# Altium project Localization.PrjPcb
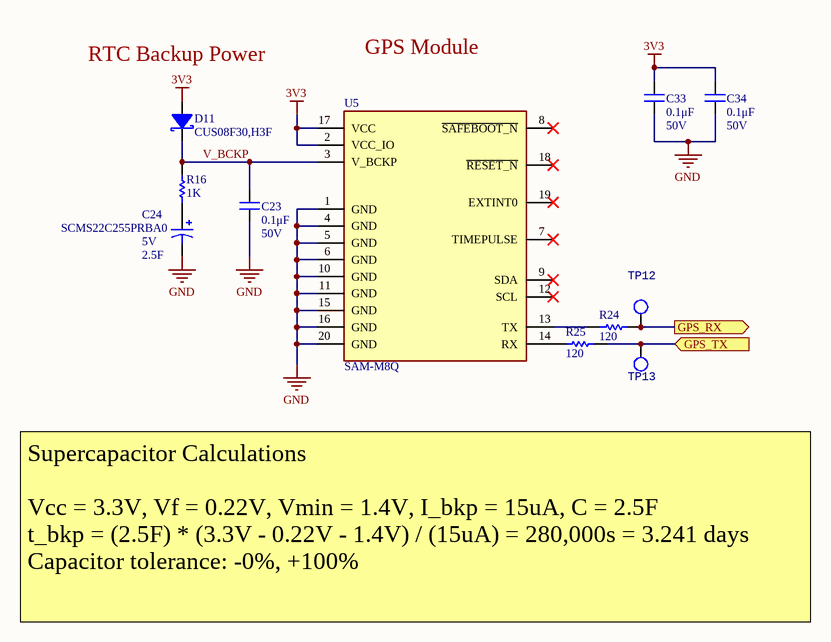
[diagram p0: GPS.SchDoc]
6 sheets, 107 parts. Net scope: flat (ports and power ports of the same name join across sheets).
Board file: Localization.PcbDoc
Sheets:
  GPS.SchDoc
  IMU.SchDoc
  MCU.SchDoc
  Power.SchDoc
  SD_CARD.SchDoc
  USB.SchDoc

## Sheet GPS.SchDoc: GPS
size B; CheckedBy: Lance Bantoto; Engineer: Cindy Li; Organization: Altium Limited; Address1: L3, 12a Rodborough Rd; Address2: Frenchs Forest; Address3: NSW; Address4: Australia 2086; Revision: 1; SheetNumber: 5; SheetTotal: 6

### Parts
C23  value 0.1μF  Voltage Rating: 50V  [CAP2012]  (hidden comment: CAP_0.1uF_50V_0805)
C24  Voltage Rating: 5V  Capacitance: 2.5F  [SCMS22C255PRBA0]  (hidden comment: CAP_2.5F_5V)
C33  value 0.1μF  Voltage Rating: 50V  [CAP2012]  (hidden comment: CAP_0.1uF_50V_0805)
C34  value 0.1μF  Voltage Rating: 50V  [CAP2012]  (hidden comment: CAP_0.1uF_50V_0805)
D11  Manufacturer Part Number 1: CUS08F30,H3F  [SOD-323_UNIDIR]  (hidden comment: DIO_SCHOTTKY_30V_800mA)
R16  value 1K  [RESC0603(1608)_N]  (hidden comment: RES_1K_0603)
R24  value 120  [RESC0603(1608)_N]  (hidden comment: RES_120R_0603)
R25  value 120  [RESC0603(1608)_N]  (hidden comment: RES_120R_0603)
TP12  TESTPOINT_LOOP  [TESTPOINT_LOOP]  (value not drawn)
TP13  TESTPOINT_LOOP  [TESTPOINT_LOOP]  (value not drawn)
U5  SAM-M8Q  [SAM-M8Q]

### Ports
GPS_RX (out), GPS_TX (in)

### Nets
3V3: C33.2 C34.2 D11.1(Anode) U5.2(VCC_IO) U5.17(VCC)
GND: C23.1 C24.2 C33.1 C34.1 U5.1(GND) U5.4(GND) U5.5(GND) U5.6(GND) U5.10(GND) U5.11(GND) U5.15(GND) U5.16(GND) U5.20(GND)
GPS_RX: R24.2 TP12.1 ; port GPS_RX
GPS_TX: R25.2 TP13.1 ; port GPS_TX
V_BCKP: C23.2 D11.2(Cathode) R16.1 U5.3(V_BCKP)
NetC24_1: C24.1 R16.2
NetR24_1: R24.1 U5.13(TX)
NetR25_1: R25.1 U5.14(RX)

Not connected (* = marked no-connect by the designer): U5 7(TIMEPULSE)* 8(~{SAFEBOOT_N})* 9(SDA)* 12(SCL)* 18(~{RESET_N})* 19(EXTINT0)*

### Notes on the sheet
- (near D11) RTC Backup Power
- GPS Module
- Supercapacitor Calculations
  Vcc = 3.3V, Vf = 0.22V, Vmin = 1.4V, I_bkp = 15uA, C = 2.5F
  t_bkp = (2.5F) * (3.3V - 0.22V - 1.4V) / (15uA) = 280,000s = 3.241 days
  Capacitor tolerance: -0%, +100%
- Title:
- Project:
- Date:
- Rev:
- Checker:
- Engineer:
- Sheet:
- of

### Library data of the parts
C23 C33 C34 = CAP_0.1uF_50V_0805: CAP CER 0.1UF 50V X7R 0805; Manufacturer 1: Murata Electronics; Manufacturer Part Number 1: GCD21BR71H104KA01L; Tolerance: 10%; Mount: Surface Mount; Case Code (Metric): 2012; Case Code (Imperial): 0805; Min Operating Temperature: -55°C; Max Operating Temperature: 125°C; Dielectric: X7R; Termination: SMD/SMT; Length: 2mm; Height: 1.25mm; Width: 0.049inch; Thickness: 0.049inch; Depth: 1.25mm; Ratings: AEC-Q200; Supplier 1: Digi-Key; Supplier Part Number 1: 490-11955-1-ND; Package: 0805 (2012 Metric)
C24 = CAP_2.5F_5V: CAP 2.5F 5V; Manufacturer 1: AVX Corporation; Tolerance: 0%, +100%; Manufacturer Part Number 1: SCMS22C255PRBA0; RoHS: Yes; Mount: Through Hole; Case/Package: Radial; Min Operating Temperature: -40°C; Max Operating Temperature: 85°C; Voltage Rating (DC): 5V; Dimensions: 0.787" L x 0.394" W (20.00mm x 10.00mm); Height - Seated (Max): 0.925" (23.50mm); Supplier 1: Digi-Key
D11 = DIO_SCHOTTKY_30V_800mA: DIODE SCHOTTKY 30V 800MA USC; Manufacturer 1: Toshiba Semiconductor and Storage; Vf (Max): 220mV; Supplier 1: Digi-Key; Supplier Part Number 1: CUS08F30H3FCT-ND; Mount: Surface Mount; Vr (Max): 30V; Io: 800mA
R16 = RES_1K_0603: RES SMD 1K OHM 5% 1/10W 0603; Manufacturer 1: Yageo; Manufacturer Part Number 1: RC0603JR-071KL; Dimensions: 0.063" L x 0.031" W (1.60mm x 0.80mm); Tolerance: 5%; Package: 0603 (1608 Metric); Supplier Part Number 1: 311-1.0KGRCT-ND; Supplier 1: Digi-Key; Mount: Surface Mount
R24 R25 = RES_120R_0603: RES SMD 120 OHM 5% 1/10W 0603; Manufacturer 1: Yageo; Manufacturer Part Number 1: RC0603JR-07120RL; Package: 0603 (1608 Metric); Dimensions: 0.063" L x 0.031" W (1.60mm x 0.80mm); Tolerance: 5%; Supplier Part Number 1: 311-120GRCT-ND; Supplier 1: Digi-Key; Mount: Surface Mount
TP12 TP13 = TESTPOINT_LOOP: PC TEST POINT MINIATURE WHITE; Manufacturer Part Number 1: 5002; Manufacturer 1: Keystone Electronics; Supplier Part Number 1: 36-5002-ND; Supplier 1: Digi-Key; Mount: Through Hole
U5 = SAM-M8Q: Rf Rx Galileo 1.575GHZ/1.602GHZ; Manufacturer 1: u-blox; Manufacturing Part Number 1: SAM-M8Q-0-10; Interface: I2C,SPI,USB,UART; Sensitivity: -165dBm; Data Rate: 400Kbps; Supplier 1: Digi-Key; Case/Package: SMD/SMT; Min Operating Temperature: -40°C; Max Operating Temperature: 85°C; Frequency: 1.602GHz; Supplier Part Number 1: 672-1054-1-ND

## Sheet IMU.SchDoc: IMU
size B; CheckedBy: Lance Bantoto; Engineer: Cindy Li; Organization: Altium Limited; Address1: L3, 12a Rodborough Rd; Address2: Frenchs Forest; Address3: NSW; Address4: Australia 2086; Revision: 1; SheetNumber: 4; SheetTotal: 6
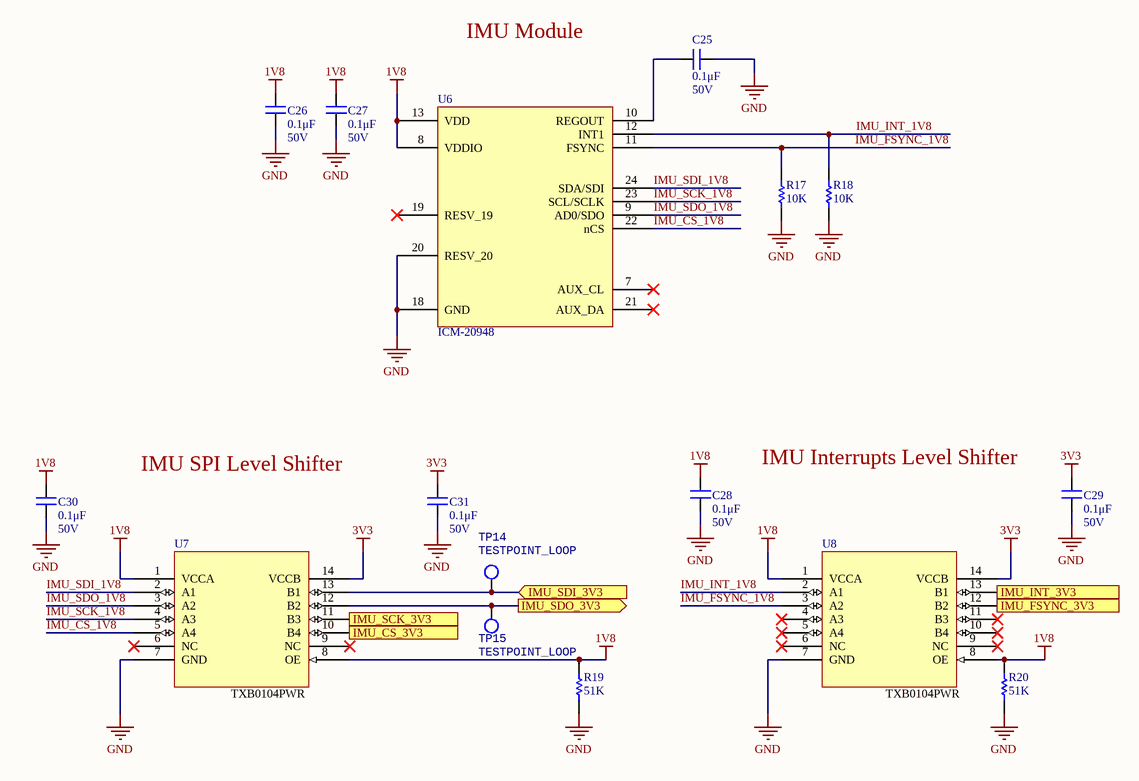
[diagram p1: IMU.SchDoc]

### Parts
C25  value 0.1μF  Voltage Rating: 50V  [CAP2012]  (hidden comment: CAP_0.1uF_50V_0805)
C26  value 0.1μF  Voltage Rating: 50V  [CAP2012]  (hidden comment: CAP_0.1uF_50V_0805)
C27  value 0.1μF  Voltage Rating: 50V  [CAP2012]  (hidden comment: CAP_0.1uF_50V_0805)
C28  value 0.1μF  Voltage Rating: 50V  [CAP2012]  (hidden comment: CAP_0.1uF_50V_0805)
C29  value 0.1μF  Voltage Rating: 50V  [CAP2012]  (hidden comment: CAP_0.1uF_50V_0805)
C30  value 0.1μF  Voltage Rating: 50V  [CAP2012]  (hidden comment: CAP_0.1uF_50V_0805)
C31  value 0.1μF  Voltage Rating: 50V  [CAP2012]  (hidden comment: CAP_0.1uF_50V_0805)
R17  value 10K  [RESC0603(1608)_N]  (hidden comment: RES_10K_0603)
R18  value 10K  [RESC0603(1608)_N]  (hidden comment: RES_10K_0603)
R19  value 51K  [RESC1608X55N]  (hidden comment: RES_51K_0603)
R20  value 51K  [RESC1608X55N]  (hidden comment: RES_51K_0603)
TP14  TESTPOINT_LOOP  [TESTPOINT_LOOP]
TP15  TESTPOINT_LOOP  [TESTPOINT_LOOP]
U6  IC_9DOF_IMU  [ICM-20948]  (value not drawn)
U7  TXB0104PWR  [PW14]
U8  TXB0104PWR  [PW14]

### Ports
IMU_CS_3V3 (in), IMU_FSYNC_3V3 (in), IMU_INT_3V3 (out), IMU_SCK_3V3 (in), IMU_SDI_3V3 (in), IMU_SDO_3V3 (out)

### Nets
1V8: C26.2 C27.2 C28.2 C30.2 R19.2 R20.2 U6.8(VDDIO) U6.13(VDD) U7.1(VCCA) U7.8(OE) U8.1(VCCA) U8.8(OE)
3V3: C29.2 C31.2 U7.14(VCCB) U8.14(VCCB)
GND: C25.2 C26.1 C27.1 C28.1 C29.1 C30.1 C31.1 R17.1 R18.1 R19.1 R20.1 U6.18(GND) U6.20(RESV_20) U7.7(GND) U8.7(GND)
IMU_CS_1V8: U6.22(nCS) U7.5(A4)
IMU_CS_3V3: U7.10(B4) ; port IMU_CS_3V3
IMU_FSYNC_1V8: R17.2 U6.11(FSYNC) U8.3(A2)
IMU_FSYNC_3V3: U8.12(B2) ; port IMU_FSYNC_3V3
IMU_INT_1V8: R18.2 U6.12(INT1) U8.2(A1)
IMU_INT_3V3: U8.13(B1) ; port IMU_INT_3V3
IMU_SCK_1V8: U6.23(SCL/SCLK) U7.4(A3)
IMU_SCK_3V3: U7.11(B3) ; port IMU_SCK_3V3
IMU_SDI_1V8: U6.24(SDA/SDI) U7.2(A1)
IMU_SDI_3V3: TP14.1 U7.13(B1) ; port IMU_SDI_3V3
IMU_SDO_1V8: U6.9(AD0/SDO) U7.3(A2)
IMU_SDO_3V3: TP15.1 U7.12(B2) ; port IMU_SDO_3V3
NetC25_1: C25.1 U6.10(REGOUT)

Not connected (* = marked no-connect by the designer): U6 7(AUX_CL)* 19(RESV_19)* 21(AUX_DA)*; U7 6(NC)* 9(NC)*; U8 4(A3)* 5(A4)* 6(NC)* 9(NC)* 10(B4)* 11(B3)*

### Notes on the sheet
- IMU Module
- IMU SPI Level Shifter
- (near C29) IMU Interrupts Level Shifter
- Title:
- Project:
- Date:
- Rev:
- Checker:
- Engineer:
- Sheet:
- of

### Library data of the parts
C25-C31 = CAP_0.1uF_50V_0805: as C23 on sheet GPS; Mount: Surface Mount; Case Code (Metric): 2012; Case Code (Imperial): 0805; Min Operating Temperature: -55°C; Max Operating Temperature: 125°C; Dielectric: X7R; Termination: SMD/SMT; Length: 2mm; Height: 1.25mm; Width: 0.049inch; Thickness: 0.049inch; Depth: 1.25mm; Ratings: AEC-Q200; Supplier 1: Digi-Key; Supplier Part Number 1: 490-11955-1-ND; Package: 0805 (2012 Metric)
R17 R18 = RES_10K_0603: RES SMD 10K OHM 5% 1/10W 0603; Manufacturer 1: Yageo; Manufacturer Part Number 1: RC0603JR-0710KL; Package: 0603 (1608 Metric); Dimensions: 0.063" L x 0.031" W (1.60mm x 0.80mm); Tolerance: 5%; Supplier Part Number 1: 311-10KGRCT-ND; Supplier 1: Digi-Key; Mount: Surface Mount
R19 R20 = RES_51K_0603: RES SMD 51K OHM 5% 1/10W 0603; Manufacturer 1: Yageo; Manufacturer Part Number 1: RC0603JR-0751KL; Package: 0603 (1608 Metric); Dimensions: 0.063" L x 0.031" W (1.60mm x 0.80mm); Tolerance: 5%; Supplier Part Number 1: 311-51KGRCT-ND; Supplier 1: Digi-Key; Mount: Surface Mount
TP14 TP15 = TESTPOINT_LOOP: as TP12 on sheet GPS; Supplier Part Number 1: 36-5002-ND; Supplier 1: Digi-Key; Mount: Through Hole
U6 = IC_9DOF_IMU: IMU ACCEL/GYRO/COMPI2C/SPI 24QFN; Manufacturer: TDK InvenSense; Sensor Type: Accelerometer,Gyroscope,Magnetometer; Output Type: SPI,I2C; Supplier 1: Digi-Key; Category: Inertial Measurement Units (IMUs); Mount: Surface Mount; Case/Package: QFN; Min Operating Temperature: -40°C; Max Operating Temperature: 85°C; Supplier Part Number 1: 1428-1123-1-ND; Manufacturer Part Number: ICM-20948
U7 U8 = IC_4CH_LVL_SHIFTER: 4-Bit Bidirectional Voltage-Level Translator with Auto Direction Sensing / VCCA < VCCB, see datasheet; Manufacturer 1: Texas Instruments; PACKAGE_DESIGNATOR: PW; PIN_COUNT: 14; FAMILY_NAME: AUTO DIRECTION SENSING DUAL SUPPLY TRANSLATOR; INDUSTRY_STD_PKG_TYPE: TSSOP; VCCB MAX: 5.5 V; VCCA MAX: 3.6 V; GENERIC_PART_NUMBER: TXB0104; Datasheet_URL: http://www.ti.com/lit/gpn/TXB0104; Supplier 1: Digi-Key; Supplier Part Number 1: 296-21929-1-ND; Manufacturer Part Number 1: TXB0104PWR

## Sheet MCU.SchDoc: Microcontroller
size B; CheckedBy: Lance Bantoto; Engineer: Cindy Li; Organization: Altium Limited; Address1: L3, 12a Rodborough Rd; Address2: Frenchs Forest; Address3: NSW; Address4: Australia 2086; Revision: 1; SheetNumber: 3; SheetTotal: 6
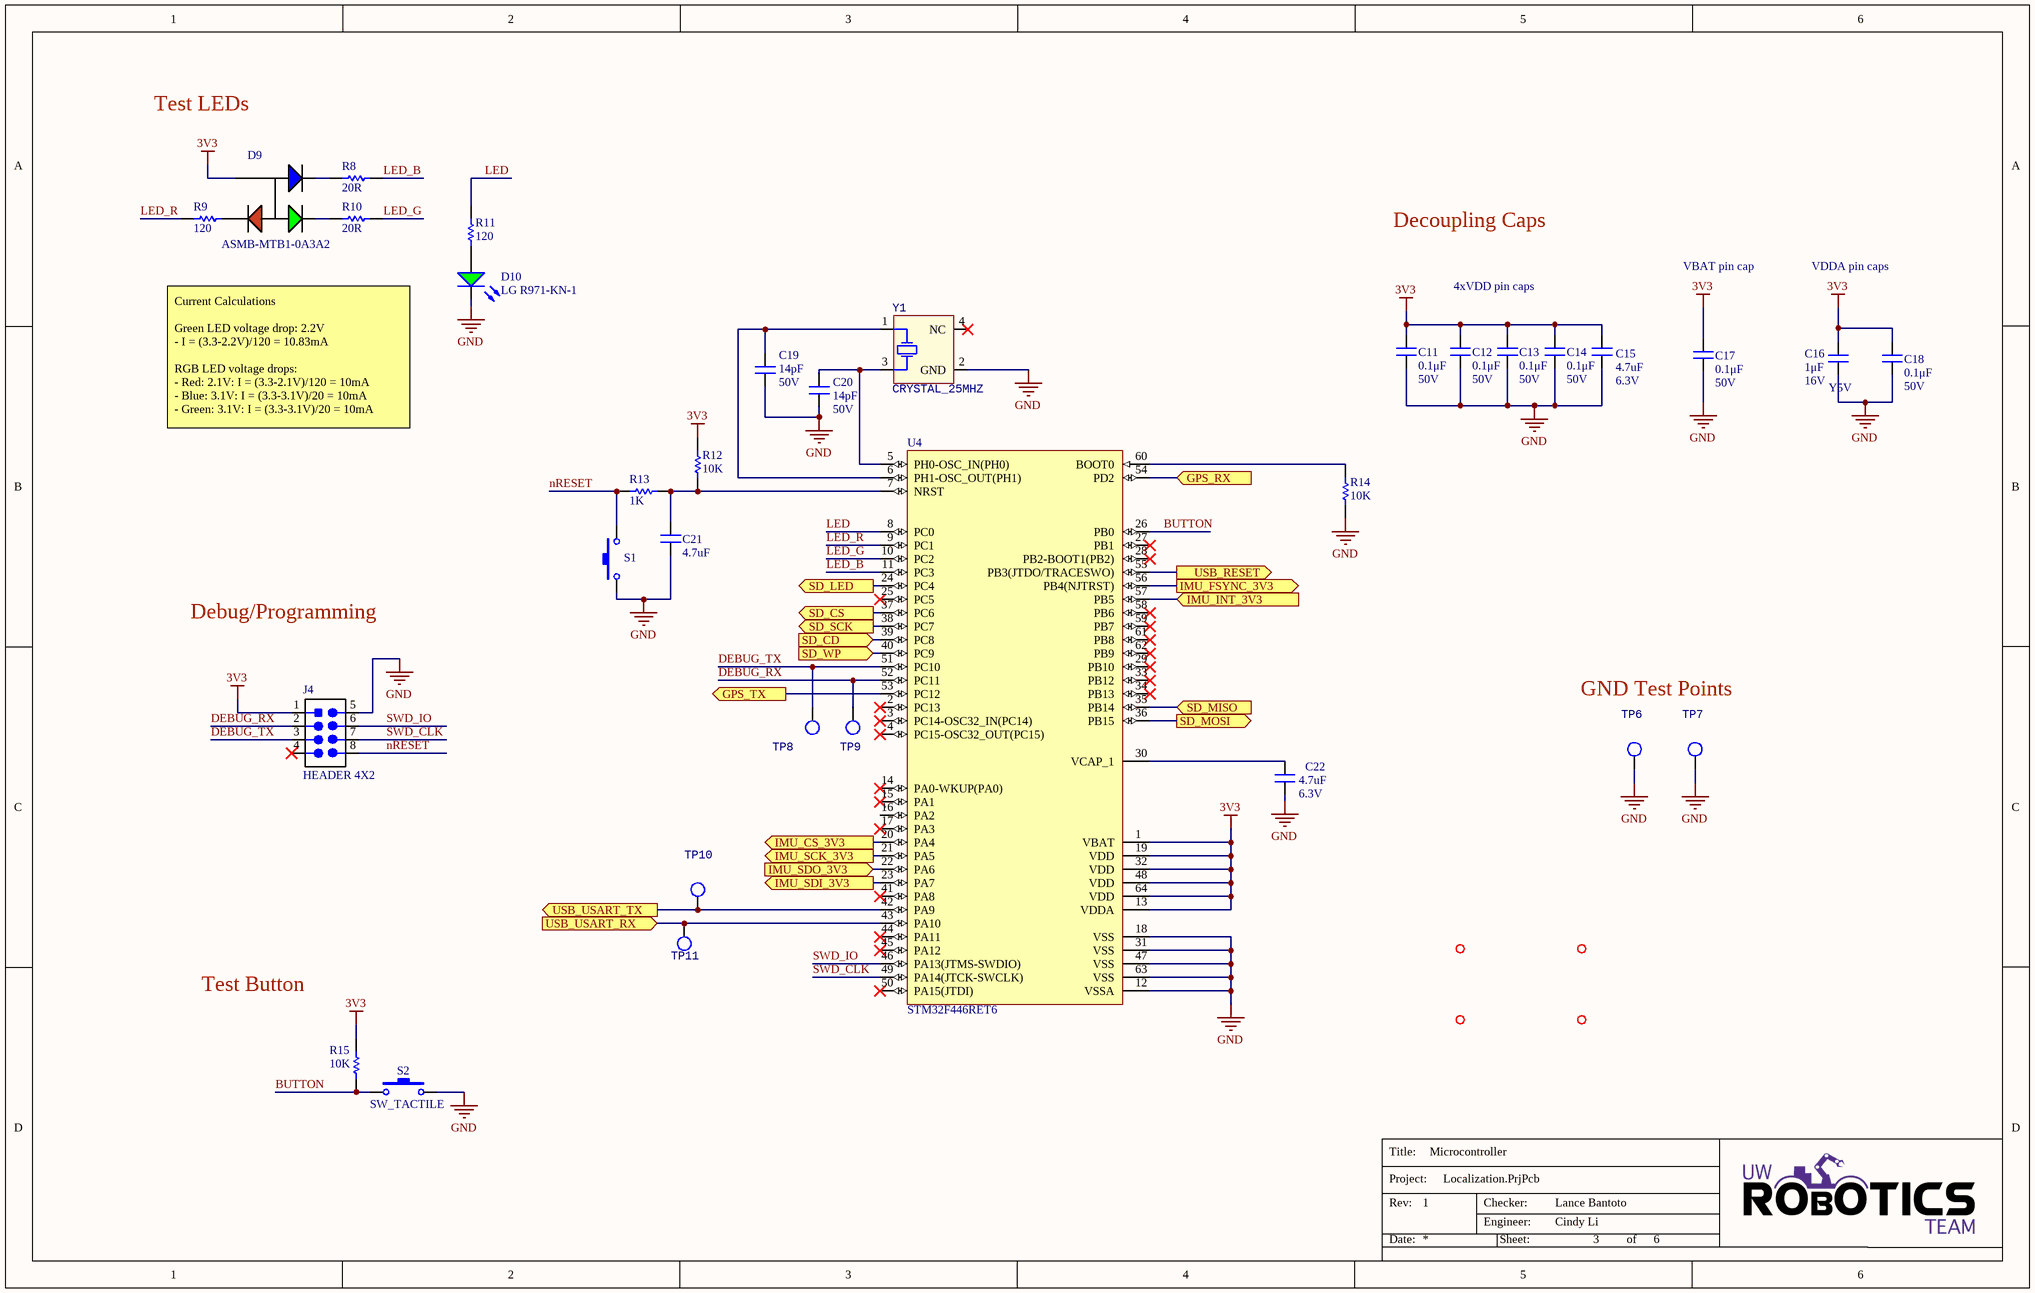
[diagram p2: MCU.SchDoc]

### Parts
C11  value 0.1μF  Voltage Rating: 50V  [CAP2012]  (hidden comment: CAP_0.1uF_50V_0805)
C12  value 0.1μF  Voltage Rating: 50V  [CAP2012]  (hidden comment: CAP_0.1uF_50V_0805)
C13  value 0.1μF  Voltage Rating: 50V  [CAP2012]  (hidden comment: CAP_0.1uF_50V_0805)
C14  value 0.1μF  Voltage Rating: 50V  [CAP2012]  (hidden comment: CAP_0.1uF_50V_0805)
C15  value 4.7uF  Voltage Rating: 6.3V  [CAPC0603(1608)55_N]  (hidden comment: CAP_4.7uF_0603)
C16  value 1μF  Voltage Rating: 16V  Dielectric: Y5V  [CAP0603]  (hidden comment: CAP_1uF_16V_0603)
C17  value 0.1μF  Voltage Rating: 50V  [CAP2012]  (hidden comment: CAP_0.1uF_50V_0805)
C18  value 0.1μF  Voltage Rating: 50V  [CAP2012]  (hidden comment: CAP_0.1uF_50V_0805)
C19  value 14pF  Voltage Rating (DC): 50V  [CAPC0603(1608)55_N]  (hidden comment: CL10C140JB8NNNC)
C20  value 14pF  Voltage Rating (DC): 50V  [CAPC0603(1608)55_N]  (hidden comment: CL10C140JB8NNNC)
C21  value 4.7uF  [CAPC0603(1608)55_N]  (hidden comment: CAP_4.7uF_0603)
C22  value 4.7uF  Voltage Rating: 6.3V  [CAPC0603(1608)55_N]  (hidden comment: CAP_4.7uF_0603)
D9  Manufacturer Part Number 1: ASMB-MTB1-0A3A2  [LED_RGB]  (hidden comment: LED_RGB)
D10  LG R971-KN-1  [LED_0805_GREEN]
J4  HEADER 4X2  [HEADER_2X4]
MH1  MOUNTING_HOLES  [MOUNTING_HOLE]  (value not drawn)
MH2  MOUNTING_HOLES  [MOUNTING_HOLE]  (value not drawn)
MH3  MOUNTING_HOLES  [MOUNTING_HOLE]  (value not drawn)
MH4  MOUNTING_HOLES  [MOUNTING_HOLE]  (value not drawn)
R8  value 20R  [RESC0603(1608)_N]  (hidden comment: RES_20R_0603)
R9  value 120  [RESC0603(1608)_N]  (hidden comment: RES_120R_0603)
R10  value 20R  [RESC0603(1608)_N]  (hidden comment: RES_20R_0603)
R11  value 120  [RESC0603(1608)_N]  (hidden comment: RES_120R_0603)
R12  value 10K  [RESC0603(1608)_N]  (hidden comment: RES_10K_0603)
R13  value 1K  [RESC0603(1608)_N]  (hidden comment: RES_1K_0603)
R14  value 10K  [RESC0603(1608)_N]  (hidden comment: RES_10K_0603)
R15  value 10K  [RESC0603(1608)_N]  (hidden comment: RES_10K_0603)
S1  SW_TACTILE  [B3U-1000P]  (value not drawn)
S2  SW_TACTILE  [B3U-1000P]
TP6  TESTPOINT_LOOP  [TESTPOINT_LOOP]  (value not drawn)
TP7  TESTPOINT_LOOP  [TESTPOINT_LOOP]  (value not drawn)
TP8  TESTPOINT_LOOP  [TESTPOINT_LOOP]  (value not drawn)
TP9  TESTPOINT_LOOP  [TESTPOINT_LOOP]  (value not drawn)
TP10  TESTPOINT_LOOP  [TESTPOINT_LOOP]  (value not drawn)
TP11  TESTPOINT_LOOP  [TESTPOINT_LOOP]  (value not drawn)
U4  STM32F446RET6  [STM-LQFP64_L]
Y1  CRYSTAL_25MHZ  [SOIC254P1016X440-4N]

### Ports
GPS_RX (in), GPS_TX (out), IMU_CS_3V3 (out), IMU_FSYNC_3V3 (out), IMU_INT_3V3 (in), IMU_SCK_3V3 (out), IMU_SDI_3V3 (out), IMU_SDO_3V3 (in), SD_CD (in), SD_CS (out), SD_LED (out), SD_MISO (in), SD_MOSI (out), SD_SCK (out), SD_WP (in), USB_RESET (out), USB_USART_RX (in), USB_USART_TX (out)

### Nets
3V3: C11.2 C12.2 C13.2 C14.2 C15.2 C16.2 C17.2 C18.2 D9.4(COMMON_ANODE) J4.1(VCC) R12.2 R15.1 U4.1(VBAT) U4.13(VDDA) U4.19(VDD) U4.32(VDD) U4.48(VDD) U4.64(VDD)
GND: C11.1 C12.1 C13.1 C14.1 C15.1 C16.1 C17.1 C18.1 C19.1 C20.1 C21.1 C22.1 D10.2(K) J4.5(GND) R14.2 S1.1 S2.2 TP6.1 TP7.1 U4.12(VSSA) U4.18(VSS) U4.31(VSS) U4.47(VSS) U4.63(VSS) Y1.2(GND)
BUTTON: R15.2 S2.1 U4.26(PB0)
DEBUG_RX: J4.2 TP9.1 U4.52(PC11)
DEBUG_TX: J4.3 TP8.1 U4.51(PC10)
GPS_RX: U4.54(PD2) ; port GPS_RX
GPS_TX: U4.53(PC12) ; port GPS_TX
IMU_CS_3V3: U4.20(PA4) ; port IMU_CS_3V3
IMU_FSYNC_3V3: U4.56(PB4(NJTRST)) ; port IMU_FSYNC_3V3
IMU_INT_3V3: U4.57(PB5) ; port IMU_INT_3V3
IMU_SCK_3V3: U4.21(PA5) ; port IMU_SCK_3V3
IMU_SDI_3V3: U4.23(PA7) ; port IMU_SDI_3V3
IMU_SDO_3V3: U4.22(PA6) ; port IMU_SDO_3V3
LED: R11.1 U4.8(PC0)
LED_B: R8.2 U4.11(PC3)
LED_G: R10.2 U4.10(PC2)
LED_R: R9.1 U4.9(PC1)
nRESET: J4.8 R13.1 S1.2
SD_CD: U4.39(PC8) ; port SD_CD
SD_CS: U4.37(PC6) ; port SD_CS
SD_LED: U4.24(PC4) ; port SD_LED
SD_MISO: U4.35(PB14) ; port SD_MISO
SD_MOSI: U4.36(PB15) ; port SD_MOSI
SD_SCK: U4.38(PC7) ; port SD_SCK
SD_WP: U4.40(PC9) ; port SD_WP
SWD_CLK: J4.7 U4.49(PA14(JTCK-SWCLK))
SWD_IO: J4.6 U4.46(PA13(JTMS-SWDIO))
USB_RESET: U4.55(PB3(JTDO/TRACESWO)) ; port USB_RESET
USB_USART_RX: TP11.1 U4.43(PA10) ; port USB_USART_RX
USB_USART_TX: TP10.1 U4.42(PA9) ; port USB_USART_TX
NetC19_2: C19.2 U4.6(PH1-OSC_OUT(PH1)) Y1.1(HOT)
NetC20_2: C20.2 U4.5(PH0-OSC_IN(PH0)) Y1.3(HOT)
NetC21_2: C21.2 R12.1 R13.2 U4.7(NRST)
NetC22_2: C22.2 U4.30(VCAP_1)
NetD9_1: D9.1(CATHODE_(RED)) R9.2
NetD9_2: D9.2(CATHODE_(GREEN)) R10.1
NetD9_3: D9.3(CATHODE_(BLUE)) R8.1
NetD10_1: D10.1(A) R11.2
NetR14_1: R14.1 U4.60(BOOT0)

Not connected (* = marked no-connect by the designer): J4 4*; U4 2(PC13)* 3(PC14-OSC32_IN(PC14))* 4(PC15-OSC32_OUT(PC15))* 14(PA0-WKUP(PA0))* 15(PA1)* 16(PA2) 17(PA3)* 25(PC5)* 27(PB1)* 28(PB2-BOOT1(PB2))* 29(PB10)* 33(PB12)* 34(PB13)* 41(PA8)* 44(PA11)* 45(PA12)* 50(PA15(JTDI))* 58(PB6)* 59(PB7)* 61(PB8)* 62(PB9)*; Y1 4(NC)*

### Notes on the sheet
- Test LEDs
- Decoupling Caps
- 4xVDD pin caps
- VBAT pin cap
- VDDA pin caps
- Current Calculations
  Green LED voltage drop: 2.2V
  - I = (3.3-2.2V)/120 = 10.83mA
  RGB LED voltage drops:
  - Red: 2.1V: I = (3.3-2.1V)/120 = 10mA
  - Blue: 3.1V: I = (3.3-3.1V)/20 = 10mA
  - Green: 3.1V: I = (3.3-3.1V)/20 = 10mA
- Debug/Programming
- GND Test Points
- Test Button
- Title:
- Project:
- Date:
- Rev:
- Checker:
- Engineer:
- Sheet:
- of

### Library data of the parts
C11-C14 C17 C18 = CAP_0.1uF_50V_0805: as C23 on sheet GPS; Mount: Surface Mount; Case Code (Metric): 2012; Case Code (Imperial): 0805; Min Operating Temperature: -55°C; Max Operating Temperature: 125°C; Dielectric: X7R; Termination: SMD/SMT; Length: 2mm; Height: 1.25mm; Width: 0.049inch; Thickness: 0.049inch; Depth: 1.25mm; Ratings: AEC-Q200; Supplier 1: Digi-Key; Supplier Part Number 1: 490-11955-1-ND; Package: 0805 (2012 Metric)
C15 C21 C22 = CAP_4.7uF_0603: CAP CER 4.7UF 6.3V X5R 0603; Manufacturer Part Number 1: CC0603KRX5R5BB475; Manufacturer 1: Yageo; Dimensions: 0.063" L x 0.031" W (1.60mm x 0.80mm); Package: 0603 (1608 Metric); Temperature Coefficient: X5R; Supplier Part Number 1: 311-1521-1-ND; Supplier 1: Digi-Key; Mount: Surface Mount
  C21: Voltage Rating: 6.3V
C16 = CAP_1uF_16V_0603: CAP CER 1UF 16V Y5V 0603; Manufacturer 1: Yageo; Manufacturer Part Number: CC0603ZRY5V7BB105; Dimensions: 0.063" L x 0.031" W (1.60mm x 0.80mm); Package: 0603 (1608 Metric); Temperature Coefficient: Y5V; Supplier Part Number 1: 311-1372-1-ND; Supplier 1: Digi-Key; Mount: Surface Mount; Case Code (Imperial): 0603; Case Code (Metric): 1608; Manufacturer Part Number 1: CC0603ZRY5V7BB105
C19 C20 = CL10C140JB8NNNC: Cap Ceramic 14pF 50V C0G 5% SMD 0603 125C Cardboard T/R; Manufacturer 1: Samsung; Voltage Rating: 50V; Supplier Part Number 1: 1276-2187-1-ND; Supplier 1: Digi-Key; Manufacturer Part Number 1: CL10C140JB8NNNC; Stock 1: 187088; Pricing 1: 1=0.10000, 10=0.06700, 100=0.02980, 500=0.02130, 1000=0.01673 (USD); RoHS: Yes; Mount: Surface Mount; Case/Package: 0603; Case Code (Metric): 1608; Case Code (Imperial): 0603; Min Operating Temperature: -55°C; Max Operating Temperature: 125°C; Tolerance: 5%; Package Quantity: 1; Packaging: Tape and Reel; Dielectric: C0G; Length: 1.6mm; Height: 0.8mm; Width: 0.031inch; Depth: 0.8mm; Thickness: 0.035inch; Radiation Hardening: No; ComponentLink1URL: https://datasheet.ciiva.com/25782/cl10c140jb8nnnc-25782947.pdf?src-supplier=Digi-Key; ComponentLink1Description: https://datasheet.ciiva.com/25782/cl10c140jb8nnnc-25782947.pdf?src-supplier=Digi-Key; Capacitance: 14pF
D9 = LED_RGB: LED RGB DIFFUSED 4PLCC SMD; Manufacturer 1: Broadcom; Color: Blue,Green,Red; Lens Color: White; Viewing Angle: 115°; Lens Style: Round; Luminous Intensity: 350mcd; Dominant Wavelength: 470nm; Forward Voltage: 3.1V; Test Current: 20mA; Supplier 1: Digi-Key; Mount: Surface Mount; Case/Package: PLCC; Number of Pins: 4; Lens Transparency: Diffused; Length: 3.2mm; Height: 1.9mm; Width: 2.8mm; REACH SVHC: No SVHC; Supplier Part Number 1: 516-3280-1-ND
D10 = DIO_LED_G: LED GREEN DIFFUSED 0805 SMD; Manufacturer 1: OSRAM; Forward Voltage Drop: 2.2V; Package: 0805 (2012 Metric); Supplier Part Number 1: 475-1410-1-ND; Supplier 1: Digi-Key; Manufacturer Part Number 1: LG R971-KN-1; Mount: Surface Mount
J4 = HEADER 4X2: CONN HEADER VERT 8POS 2.54MM; Manufacturer Part Number 1: M20-9980445; Manufacturer 1: Harwin Inc.; Supplier Part Number 1: 952-2122-ND; Supplier 1: Digi-Key; Mount: Through Hole
MH1-MH4 = MOUNTING_HOLES: 6cm x 6cm
R8 R10 = RES_20R_0603: RES SMD 20 OHM 5% 1/10W 0603; Manufacturer 1: Yageo; Manufacturer Part Number 1: RC0603JR-0720RL; Package: 0603 (1608 Metric); Dimensions: 0.063" L x 0.031" W (1.60mm x 0.80mm); Tolerance: 5%; Supplier Part Number 1: 311-20GRCT-ND; Supplier 1: Digi-Key; Mount: Surface Mount
R9 R11 = RES_120R_0603: as R24 on sheet GPS; Package: 0603 (1608 Metric); Dimensions: 0.063" L x 0.031" W (1.60mm x 0.80mm); Tolerance: 5%; Supplier Part Number 1: 311-120GRCT-ND; Supplier 1: Digi-Key; Mount: Surface Mount
R12 R14 R15 = RES_10K_0603: as R17 on sheet IMU; Package: 0603 (1608 Metric); Dimensions: 0.063" L x 0.031" W (1.60mm x 0.80mm); Tolerance: 5%; Supplier Part Number 1: 311-10KGRCT-ND; Supplier 1: Digi-Key; Mount: Surface Mount
R13 = RES_1K_0603: as R16 on sheet GPS; Dimensions: 0.063" L x 0.031" W (1.60mm x 0.80mm); Tolerance: 5%; Package: 0603 (1608 Metric); Supplier Part Number 1: 311-1.0KGRCT-ND; Supplier 1: Digi-Key; Mount: Surface Mount
S1 S2 = SW_TACTILE: Tactile Switch (Grey); Manufacturer 1: Omron Electronics Inc-EMC Div; Supplier Part Number 1: SW1020CT-ND; Supplier 1: Digi-Key; Manufacturer Part Number 1: B3U-1000P; Mount: Surface Mount
TP6-TP11 = TESTPOINT_LOOP: as TP12 on sheet GPS; Supplier Part Number 1: 36-5002-ND; Supplier 1: Digi-Key; Mount: Through Hole
U4 = MCU_STM32F446RET6: ARM Cortex-M4 32-bit MCU+FPU, 512 KB Flash, 128 KB Internal RAM, 50 I/Os, 64-Pin LQFP, -40 to 85 degC, Tray; I/Os (High Current): 50; Supply Voltage(Vcc) min (V): 1.7; Operating Frequency(F) (Processor speed) (MHz): 180; D/A Converter: 2; Internal RAM Size (kB): 128; FLASH Size (Prog) (kB): 512; Core: ARM Cortex-M4; ComponentLink1Description: Manufacturer URL; Package Reference: 64-Pin Low-profile Quad Flat Package, Body 10 x 10 mm, Pitch 0.5 mm; ComponentLink2URL: http://www.st.com/st-web-ui/static/active/en/resource/technical/document/datasheet/DM00141306.pdf; Packing: Tray; DatasheetVersion: Rev. 6; ComponentLink1URL: http://www.st.com/; ComponentLink2Description: Datasheet; Package Description: LQFP64; Mounting Technology: Surface Mount; Supplier Part Number 1: 497-15376-ND; Supplier 1: Digi-Key
Y1 = CRYSTAL_25MHZ: CRYSTAL 25.0000MHZ 12PF SMD; Manufacturer 1: Kyocera AVX; Manufacturer Part Number 1: CX2520DB25000H0FLJC1; Frequency: 25MHz; ESR (Equivalent Series Resistance): 80R; Frequency Stability: 15ppm; Frequency Tolerance: 10ppm; Supplier 1: Digi-Key; Supplier Part Number 1: 1253-1724-1-ND; Mount: Surface Mount; Case/Package: SMD/SMT; Min Operating Temperature: -30°C; Max Operating Temperature: 85°C; Load Capacitance: 12pF; Length: 0.098inch; Height: 0.022inch; Width: 0.079inch; Ratings: AEC-Q200

## Sheet Power.SchDoc: Power
size B; CheckedBy: Lance Bantoto; Engineer: Cindy Li; Organization: Altium Limited; Address1: L3, 12a Rodborough Rd; Address2: Frenchs Forest; Address3: NSW; Address4: Australia 2086; Revision: 1; SheetNumber: 1; SheetTotal: 6
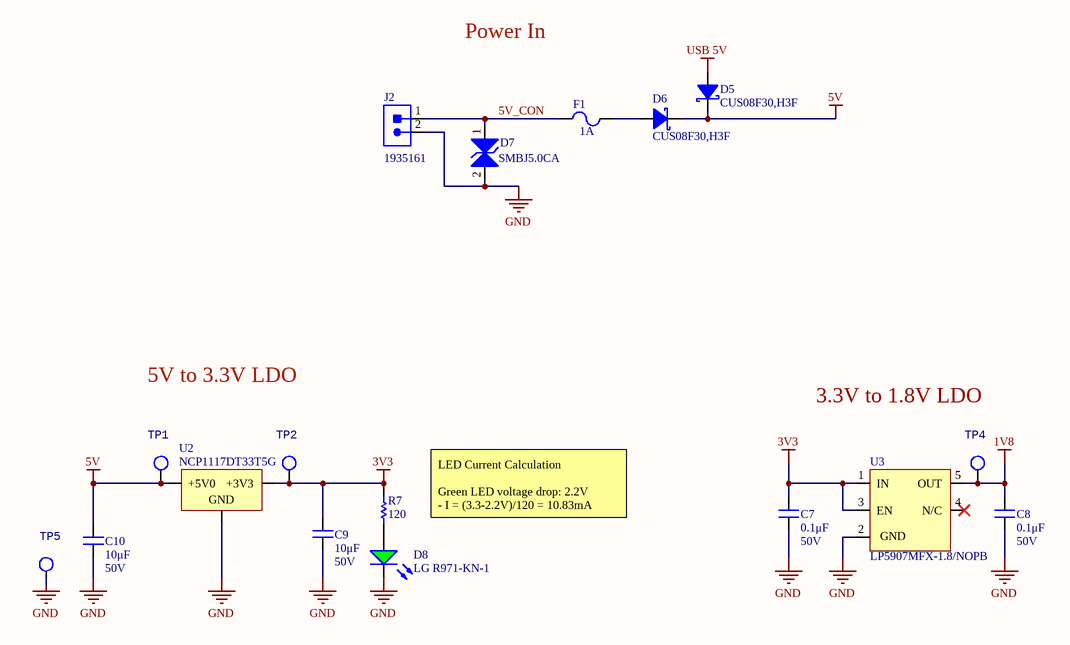
[diagram p3: Power.SchDoc]

### Parts
C7  value 0.1μF  Voltage Rating: 50V  [CAP2012]  (hidden comment: CAP_0.1uF_50V_0805)
C8  value 0.1μF  Voltage Rating: 50V  [CAP2012]  (hidden comment: CAP_0.1uF_50V_0805)
C9  value 10μF  Voltage Rating: 50V  [CAP1206]  (hidden comment: CAP_10uF_50V_1206)
C10  value 10μF  Voltage Rating: 50V  [CAP1206]  (hidden comment: CAP_10uF_50V_1206)
D5  Manufacturer Part Number 1: CUS08F30,H3F  [SOD-323_UNIDIR]  (hidden comment: DIO_SCHOTTKY_30V_800mA)
D6  Manufacturer Part Number 1: CUS08F30,H3F  [SOD-323_UNIDIR]  (hidden comment: DIO_SCHOTTKY_30V_800mA)
D7  Manufacturer Part Number 1: SMBJ5.0CA  [TVS_DIODE_BIDIRECTIONAL]  (hidden comment: TVS_DIODE_BIDIR_5V)
D8  LG R971-KN-1  [LED_0805_GREEN]
F1  Current Rating: 1A  [FUSE_1206]  (hidden comment: FUSE_1A_1206)
J2  1935161  [1935161]
R7  value 120  [RESC0603(1608)_N]  (hidden comment: RES_120R_0603)
TP1  TESTPOINT_LOOP  [TESTPOINT_LOOP]  (value not drawn)
TP2  TESTPOINT_LOOP  [TESTPOINT_LOOP]  (value not drawn)
TP4  TESTPOINT_LOOP  [TESTPOINT_LOOP]  (value not drawn)
TP5  TESTPOINT_LOOP  [TESTPOINT_LOOP]  (value not drawn)
U2  Manufacturer Part Number 1: NCP1117DT33T5G  [VOLTAGE_REGULATOR]  (hidden comment: 5V0_3V3_LDO)
U3  LDO_1.8V_250mA  [LP5907MFX-1.8/NOPB]  (value not drawn)

### Nets
1V8: C8.2 TP4.1 U3.5(OUT)
3V3: C7.2 C9.2 R7.2 TP2.1 U2.2(+3V3) U3.1(IN) U3.3(EN)
5V: C10.2 D5.2(Cathode) D6.2(Cathode) TP1.1 U2.3(+5V0)
GND: C7.1 C8.1 C9.1 C10.1 D7.2 D8.2(K) J2.2 TP5.1 U2.1(GND) U3.2(GND)
USB 5V: D5.1(Anode)
5V_CON: D7.1 F1.1 J2.1
NetD6_1: D6.1(Anode) F1.2
NetD8_1: D8.1(A) R7.1

Not connected (* = marked no-connect by the designer): U3 4(N/C)*

### Notes on the sheet
- Power In
- 5V to 3.3V LDO
- 3.3V to 1.8V LDO
- LED Current Calculation
  Green LED voltage drop: 2.2V
  - I = (3.3-2.2V)/120 = 10.83mA
- Title:
- Project:
- Date:
- Rev:
- Checker:
- Engineer:
- Sheet:
- of

### Library data of the parts
C7 C8 = CAP_0.1uF_50V_0805: as C23 on sheet GPS; Mount: Surface Mount; Case Code (Metric): 2012; Case Code (Imperial): 0805; Min Operating Temperature: -55°C; Max Operating Temperature: 125°C; Dielectric: X7R; Termination: SMD/SMT; Length: 2mm; Height: 1.25mm; Width: 0.049inch; Thickness: 0.049inch; Depth: 1.25mm; Ratings: AEC-Q200; Supplier 1: Digi-Key; Supplier Part Number 1: 490-11955-1-ND; Package: 0805 (2012 Metric)
C9 C10 = CAP_10uF_50V_1206: CAP CER 10UF 50V X5R 1206; Manufacturer Part Numer 1: GRT31CR61H106KE01L; Manufacturer 1: Murata; Dimensions: 0.126" L x 0.063" W (3.20mm x 1.6mm); Package: 1206 (3216 Metric); Supplier Part Number 1: 490-12456-1-ND; Supplier 1: Digi-Key; Mount: Surface Mount; Case Code (Imperial): 1206; Case Code (Metric): 3216; Manufacturer Part Number 1: GRT31CR61H106KE01L; Dielectric: X5R
D5 D6 = DIO_SCHOTTKY_30V_800mA: as D11 on sheet GPS; Supplier 1: Digi-Key; Supplier Part Number 1: CUS08F30H3FCT-ND; Mount: Surface Mount; Vr (Max): 30V; Io: 800mA
D7 = TVS_DIODE_BIDIR_5V: TVS DIODE 5V 9.2V DO214AA; Manufacturer 1: Littelfuse; Direction: Bidirectional; Max Surge Current: 65.3A; Reverse Breakdown Voltage: 6.4V; Peak Pulse Power: 600W; Max Breakdown Voltage: 7V; ESD Protection: Yes; Package: DO-214AA, SMB; Supplier Part Number 1: SMBJ5.0CALFCT-ND; Supplier 1: Digi-Key; Mount: Surface Mount; Min Operating Temperature: -65°C; Max Operating Temperature: 150°C; Reverse Standoff Voltage: 5V; Min Breakdown Voltage: 6.4V; Clamping Voltage: 9.2V; Breakdown Voltage: 6.4V; Polarity: Bidirectional; Power Dissipation: 600W; Peak Pulse Current: 65.3A; Composition: Zener
D8 = DIO_LED_G: as D10 on sheet MCU; Package: 0805 (2012 Metric); Supplier Part Number 1: 475-1410-1-ND; Supplier 1: Digi-Key; Manufacturer Part Number 1: LG R971-KN-1; Mount: Surface Mount
F1 = FUSE_1A_1206: FUSE BOARD MOUNT 1A 125VAC 63VDC; Manufacturer 1: Bel Fuse Inc.; Manufacturer Part Number 1: C1Q 1; Voltage Rating DC: 63V; Supplier 1: Digi-Key; Supplier Part Number 1: 507-1077-1-ND; Mount: Surface Mount
J2 = CON_2M_TERM: TERM BLK 2POS SIDE ENTRY 5MM; Manufacturer 1: Phoenix Contact; Current: 18A; Voltage: 300V; Connector Type: Screw; Voltage Rating (DC): 320V; Max Current Rating: 16A; Max Supply Voltage: 250V; Current Rating: 17.5A; Number of Poles: 2; Number of Levels: 1; Wire Gauge (Max): 26AWG; Wire Gauge (Min): 12AWG; Approvals: UL; Manufacturer Part Number 1: 1935161; Supplier Part Number 1: 277-1667-ND; Supplier 1: Digi-Key; Pitch: 5mm; Mount: Through Hole; Number of Pins: 2; Weight: 0.067021oz; Contact Material: Copper,Tin; Insulation Material: Nylon; Housing Material: Polyamide; Housing Color: Green; Color: Green; Material: Nylon; Number of Rows: 1; Voltage Rating: 250V; Number of Positions: 2; Number of Positions Per Level: 2; Termination: Solder; Number of Contacts: 2; Number of Circuits: 2; Orientation: Straight; Length: 9mm; Height: 11.3mm; Width: 14.9mm; Depth: 9mm; Wire/Cable Gauge: 26AWG; Flammability Rating: UL94 V-0; REACH SVHC: Unknown
R7 = RES_120R_0603: as R24 on sheet GPS; Package: 0603 (1608 Metric); Dimensions: 0.063" L x 0.031" W (1.60mm x 0.80mm); Tolerance: 5%; Supplier Part Number 1: 311-120GRCT-ND; Supplier 1: Digi-Key; Mount: Surface Mount
TP1 TP2 TP4 TP5 = TESTPOINT_LOOP: as TP12 on sheet GPS; Supplier Part Number 1: 36-5002-ND; Supplier 1: Digi-Key; Mount: Through Hole
U2 = 5V0_3V3_LDO: IC REG LINEAR 3.3V 1A DPAK; Manufacturer 1: ON Semiconductor; Current Output: 1A; Supplier Part Number 1: NCP1117DT33T5GOSCT-ND; Supplier 1: Digi-Key; Mount: Surface Mount
U3 = LDO_1.8V_250mA: IC REG LINEAR 1.8V 250MA SOT23-5; Manufacturer 1: Texas Instruments; Manufacturer Part Number 1: LP5907MFX-1.8/NOPB; Current Output: 250mA; Supplier Part Number 1: 296-41463-1-ND; Supplier 1: Digi-Key; Mount: Surface Mount

## Sheet SD_CARD.SchDoc: SD Card
size B; CheckedBy: Lance Bantoto; Engineer: Cindy Li; Organization: Altium Limited; Address1: L3, 12a Rodborough Rd; Address2: Frenchs Forest; Address3: NSW; Address4: Australia 2086; Revision: 1; SheetNumber: 6; SheetTotal: 6
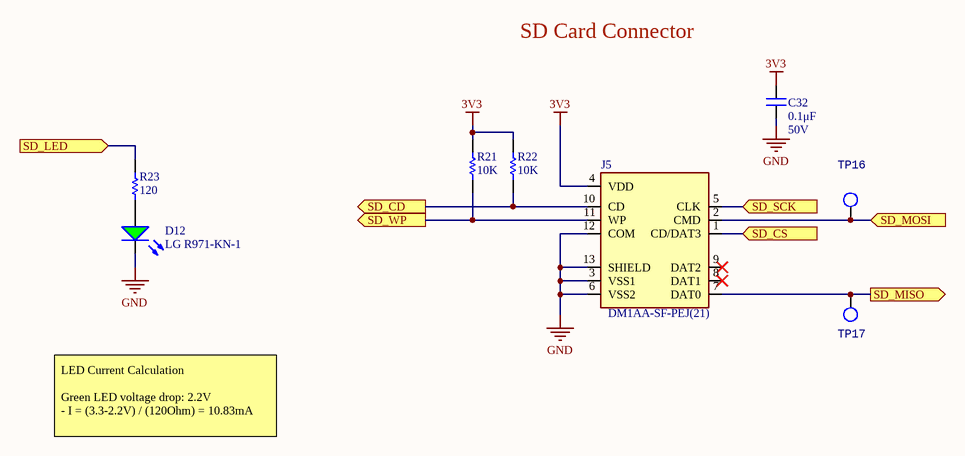
[diagram p4: SD_CARD.SchDoc]

### Parts
C32  value 0.1μF  Voltage Rating: 50V  [CAP2012]  (hidden comment: CAP_0.1uF_50V_0805)
D12  LG R971-KN-1  [LED_0805_GREEN]
J5  Manufacturer Part Number 1: DM1AA-SF-PEJ(21)  [HRS_DM1AA-SF-PEJ(21)]  (hidden comment: SD_CARD_CON)
R21  value 10K  [RESC0603(1608)_N]  (hidden comment: RES_10K_0603)
R22  value 10K  [RESC0603(1608)_N]  (hidden comment: RES_10K_0603)
R23  value 120  [RESC0603(1608)_N]  (hidden comment: RES_120R_0603)
TP16  TESTPOINT_LOOP  [TESTPOINT_LOOP]  (value not drawn)
TP17  TESTPOINT_LOOP  [TESTPOINT_LOOP]  (value not drawn)

### Ports
SD_CD (out), SD_CS (in), SD_LED (in), SD_MISO (out), SD_MOSI (in), SD_SCK (in), SD_WP (out)

### Nets
3V3: C32.2 J5.4(VDD) R21.2 R22.2
GND: C32.1 D12.2(K) J5.3(VSS1) J5.6(VSS2) J5.12(COM) J5.13(SHIELD)
SD_CD: J5.10(CD) R22.1 ; port SD_CD
SD_CS: J5.1(CD/DAT3) ; port SD_CS
SD_LED: R23.1 ; port SD_LED
SD_MISO: J5.7(DAT0) TP17.1 ; port SD_MISO
SD_MOSI: J5.2(CMD) TP16.1 ; port SD_MOSI
SD_SCK: J5.5(CLK) ; port SD_SCK
SD_WP: J5.11(WP) R21.1 ; port SD_WP
NetD12_1: D12.1(A) R23.2

Not connected (* = marked no-connect by the designer): J5 8(DAT1)* 9(DAT2)*

### Notes on the sheet
- SD Card Connector
- LED Current Calculation
  Green LED voltage drop: 2.2V
  - I = (3.3-2.2V) / (120Ohm) = 10.83mA
- Title:
- Project:
- Date:
- Rev:
- Checker:
- Engineer:
- Sheet:
- of

### Library data of the parts
C32 = CAP_0.1uF_50V_0805: as C23 on sheet GPS; Mount: Surface Mount; Case Code (Metric): 2012; Case Code (Imperial): 0805; Min Operating Temperature: -55°C; Max Operating Temperature: 125°C; Dielectric: X7R; Termination: SMD/SMT; Length: 2mm; Height: 1.25mm; Width: 0.049inch; Thickness: 0.049inch; Depth: 1.25mm; Ratings: AEC-Q200; Supplier 1: Digi-Key; Supplier Part Number 1: 490-11955-1-ND; Package: 0805 (2012 Metric)
D12 = DIO_LED_G: as D10 on sheet MCU; Package: 0805 (2012 Metric); Supplier Part Number 1: 475-1410-1-ND; Supplier 1: Digi-Key; Manufacturer Part Number 1: LG R971-KN-1; Mount: Surface Mount
J5 = SD_CARD_CON: CONN SD CARD PUSH-PUSH R/A SMD; Manufacturer 1: Hirose Electric Co Ltd; Supplier 1: Digi-Key; Supplier Part Number 1: HR845CT-ND; Mount: Surface Mount; Card Type: SD
R21 R22 = RES_10K_0603: as R17 on sheet IMU; Package: 0603 (1608 Metric); Dimensions: 0.063" L x 0.031" W (1.60mm x 0.80mm); Tolerance: 5%; Supplier Part Number 1: 311-10KGRCT-ND; Supplier 1: Digi-Key; Mount: Surface Mount
R23 = RES_120R_0603: as R24 on sheet GPS; Package: 0603 (1608 Metric); Dimensions: 0.063" L x 0.031" W (1.60mm x 0.80mm); Tolerance: 5%; Supplier Part Number 1: 311-120GRCT-ND; Supplier 1: Digi-Key; Mount: Surface Mount
TP16 TP17 = TESTPOINT_LOOP: as TP12 on sheet GPS; Supplier Part Number 1: 36-5002-ND; Supplier 1: Digi-Key; Mount: Through Hole

## Sheet USB.SchDoc: USB
size B; CheckedBy: Lance Bantoto; DrawnBy: Alaina Hansen, Cindy Li; Engineer: Cindy Li; Organization: Altium Limited; Address1: L3, 12a Rodborough Rd; Address2: Frenchs Forest; Address3: NSW; Address4: Australia 2086; Revision: 1; SheetNumber: 2; SheetTotal: 6
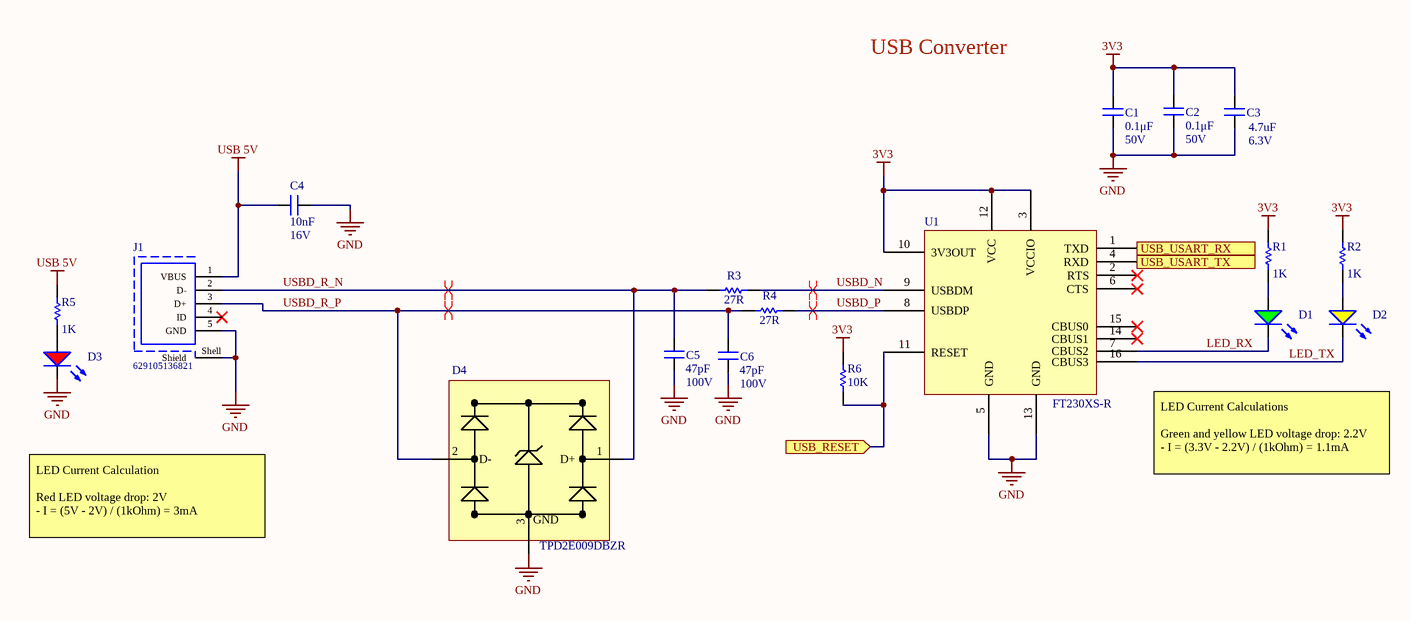
[diagram p5: USB.SchDoc]

### Parts
C1  value 0.1μF  Voltage Rating: 50V  [CAP2012]  (hidden comment: CAP_0.1uF_50V_0805)
C2  value 0.1μF  Voltage Rating: 50V  [CAP2012]  (hidden comment: CAP_0.1uF_50V_0805)
C3  value 4.7uF  Voltage Rating: 6.3V  [CAPC0603(1608)55_N]  (hidden comment: CAP_4.7uF_0603)
C4  value 10nF  Voltage Rating: 16V  [CAP0603]  (hidden comment: CAP_10nF_0603)
C5  value 47pF  Voltage Rating: 100V  [CAP0603]  (hidden comment: CAP_47pF_100V_0603)
C6  value 47pF  Voltage Rating: 100V  [CAP0603]  (hidden comment: CAP_47pF_100V_0603)
D1  LG R971-KN-1  [LED_0805_GREEN]  (value not drawn)
D2  LY R976-PS-36  [LED_0805_YELLOW]  (value not drawn)
D3  LS R976-NR-1  [LED_0805_RED]  (value not drawn)
D4  Manufacturer Part Number: TPD2E009DBZR  [SOT23-3]  (hidden comment: TVS_DIODE_USB_5.5V)
J1  629105136821  [629105136821]
R1  value 1K  [RESC0603(1608)_N]  (hidden comment: RES_1K_0603)
R2  value 1K  [RESC0603(1608)_N]  (hidden comment: RES_1K_0603)
R3  Resistance: 27R  [RESC0603(1608)_N]  (hidden comment: RES_27R_0603)
R4  Resistance: 27R  [RESC0603(1608)_N]  (hidden comment: RES_27R_0603)
R5  value 1K  [RESC0603(1608)_N]  (hidden comment: RES_1K_0603)
R6  value 10K  [RESC0603(1608)_N]  (hidden comment: RES_10K_0603)
U1  Manufacturer Part Number 1: FT230XS-R  [SSOP16-0.635-5X4MM]  (hidden comment: IC_USB_TRANSCEIVER)

### Ports
USB_RESET (in), USB_USART_RX (out), USB_USART_TX (in)

### Nets
3V3: C1.2 C2.2 C3.1 R1.2 R2.2 R6.2 U1.3(VCCIO) U1.10(3V3OUT) U1.12(VCC)
GND: C1.1 C2.1 C3.2 C4.2 C5.1 C6.2 D3.2(K) D4.3(GND) J1.5(GND) J1.Shell(Shield) U1.5(GND) U1.13(GND)
USB 5V: C4.1 J1.1(VBUS) R5.2
LED_RX: D1.2(K) U1.7(CBUS2)
LED_TX: D2.2(K) U1.16(CBUS3)
USB_RESET: R6.1 U1.11(RESET) ; port USB_RESET
USB_USART_RX: U1.1(TXD) ; port USB_USART_RX
USB_USART_TX: U1.4(RXD) ; port USB_USART_TX
USBD_N: R3.2 U1.9(USBDM)
USBD_P: R4.2 U1.8(USBDP)
USBD_R_N: C5.2 D4.1(D+) J1.2(D-) R3.1
USBD_R_P: C6.1 D4.2(D-) J1.3(D+) R4.1
NetD1_1: D1.1(A) R1.1
NetD2_1: D2.1(A) R2.1
NetD3_1: D3.1(A) R5.1

Not connected (* = marked no-connect by the designer): J1 4(ID)*; U1 2(RTS)* 6(CTS)* 14(CBUS1)* 15(CBUS0)*

### Layout directives
differential pair: USBD_N, USBD_P, USBD_R_N, USBD_R_P

### Notes on the sheet
- USB Converter
- LED Current Calculations
  Green and yellow LED voltage drop: 2.2V
  - I = (3.3V - 2.2V) / (1kOhm) = 1.1mA
- LED Current Calculation
  Red LED voltage drop: 2V
  - I = (5V - 2V) / (1kOhm) = 3mA
- Title:
- Project:
- Date:
- Rev:
- Checker:
- Engineer:
- Sheet:
- of

### Library data of the parts
C1 C2 = CAP_0.1uF_50V_0805: as C23 on sheet GPS; Mount: Surface Mount; Case Code (Metric): 2012; Case Code (Imperial): 0805; Min Operating Temperature: -55°C; Max Operating Temperature: 125°C; Dielectric: X7R; Termination: SMD/SMT; Length: 2mm; Height: 1.25mm; Width: 0.049inch; Thickness: 0.049inch; Depth: 1.25mm; Ratings: AEC-Q200; Supplier 1: Digi-Key; Supplier Part Number 1: 490-11955-1-ND; Package: 0805 (2012 Metric)
C3 = CAP_4.7uF_0603: as C15 on sheet MCU; Dimensions: 0.063" L x 0.031" W (1.60mm x 0.80mm); Package: 0603 (1608 Metric); Temperature Coefficient: X5R; Supplier Part Number 1: 311-1521-1-ND; Supplier 1: Digi-Key; Mount: Surface Mount
C4 = CAP_10nF_0603: CAP CER 10000PF 16V X7R 0603; Manufacturer Part Number 1: CC0603KRX7R7BB103; Manufacturer 1: Yageo; Supplier Part Number 1: 311-3369-1-ND; Supplier 1: Digi-Key; Mount: Surface Mount; Case Code (Imperial): 0603; Dielectric: X7R
C5 C6 = CAP_47pF_100V_0603: CAP CER 47PF 100V C0G/NP0 0603; Manufacturer Part Number 1: C0603C470J1GACTU; Manufacturer 1: KEMET; Temperature Coefficient: C0G; Dielectric: C0G, NP0; Dimensions: 0.063" L x 0.031" W (1.60mm x 0.80mm); Package: 0603 (1608 Metric); Supplier Part Number 1: 399-7917-1-ND; Supplier 1: Digi-Key; Mount: Surface Mount; Case Code (Imperial): 0603; Case Code (Metric): 1608
D1 = DIO_LED_G: as D10 on sheet MCU; Package: 0805 (2012 Metric); Manufacturer Part Number 1: LG R971-KN-1; Supplier Part Number 1: 475-1410-1-ND; Supplier 1: Digi-Key; Mount: Surface Mount
D2 = DIO_LED_Y: LED YELLOW DIFFUSED 0805 SMD; Manufacturer 1: OSRAM; Forward Voltage Drop: 2.2V; Package: 0805 (2012 Metric); Manufacturer Part Number 1: LY R976-PS-36; Supplier Part Number 1: 475-2560-1-ND; Supplier 1: Digi-Key; Mount: Surface Mount
D3 = DIO_LED_R: LED RED DIFFUSED 0805 SMD; Manufacturer 1: OSRAM; Forward Voltage Drop: 2V; Package: 0805 (2012 Metric); Manufacturer Part Number 1: LS R976-NR-1; Supplier Part Number 1: 475-1278-1-ND; Supplier 1: Digi-Key; Mount: Surface Mount
D4 = TVS_DIODE_USB_5.5V: TVS DIODE 5.5V 8V SOT23-3; Manufacturer: Texas Instruments; Direction: Unidirectional; Operating Supply Voltage: 6V; Capacitance: 0.9pF; Number of Channels: 2; Current Rating: 100nA; Peak Pulse Current: 1A; Element Configuration: Dual; Min Breakdown Voltage: 9V; Peak Pulse Power: 45W; Power Line Protection: Yes; Breakdown Voltage: 7V; Interface: LVDS,PCIe,SATA; Supplier 1: Digi-Key; Category: Interface ICs; Case/Package: SOT-23; Number of Pins: 3; Min Operating Temperature: -40°C; Max Operating Temperature: 85°C; Number of Bidirectional Channels: 2; Reverse Standoff Voltage: 5.5V; Clamping Voltage: 8V; Termination: SMD/SMT; Max Power Dissipation: 45W; Working Voltage: 5.5V; Length: 2.92mm; Height: 1mm; Width: 1.3mm; Depth: 1.3mm; REACH SVHC: No SVHC; Supplier Part Number 1: 296-24657-1-ND
J1 = WE 629105136821: CONN RCPT USB2.0 MICRO B SMD R/A; Manufacturer: Wurth Elektronik; Contact Resistance: 30mOhm; Rated Current: 1A; Working Voltage: 30VAC; Connector Type: MicroUSB2.0TypeB; Gender: Receptacle; Datasheet URL: https://katalog.we-online.de/em/datasheet/629105136821.pdf; Mounting Technology: SMT; Publisher: WurthElektronik; Package Reference: 629105136821; Orientation: Horizontal; Part Number: 629105136821; Manufacturer URL: http://www.we-online.de; Operating Temperature: -40to105degC
R1 R2 R5 = RES_1K_0603: as R16 on sheet GPS; Dimensions: 0.063" L x 0.031" W (1.60mm x 0.80mm); Tolerance: 5%; Package: 0603 (1608 Metric); Supplier Part Number 1: 311-1.0KGRCT-ND; Supplier 1: Digi-Key; Mount: Surface Mount
R3 R4 = RES_27R_0603: RES SMD 27 OHM 5% 1/10W 0603; Manufacturer: Yageo; Manufacturer Part Number: RC0603JR-0727RL; Voltage Rating (DC): 50V; Power Rating: 100mW; Temperature Coefficient: 100ppm/°C; Supplier 1: Digi-Key; RoHS: Yes; Category: Chip SMD Resistors; Stock 1: 2055343; Pricing 1: 1=0.10000, 10=0.01900, 100=0.00770, 1000=0.00347, 2500=0.00301 (USD); Case/Package: 0603; Number of Pins: 2; Case Code (Imperial): 0603; Case Code (Metric): 1608; Min Operating Temperature: -55°C; Max Operating Temperature: 155°C; Tolerance: 5%; Voltage Rating: 50V; Packaging: Tape and Reel; Termination: SMD/SMT; Composition: Thick Film; Military Standard: Not; Length: 1.6mm; Width: 0.8mm; Depth: 0.8mm; Lead Free: Lead Free; REACH SVHC: No SVHC; ComponentLink1URL: https://datasheet.ciiva.com/7746/443971-7746479.pdf?src-supplier=Element14; ComponentLink1Description: https://datasheet.ciiva.com/7746/443971-7746479.pdf?src-supplier=Element14; Supplier Part Number 1: 311-27GRCT-ND
R6 = RES_10K_0603: as R17 on sheet IMU; Package: 0603 (1608 Metric); Dimensions: 0.063" L x 0.031" W (1.60mm x 0.80mm); Tolerance: 5%; Supplier Part Number 1: 311-10KGRCT-ND; Supplier 1: Digi-Key; Mount: Surface Mount
U1 = IC_USB_TRANSCEIVER: IC USB SERIAL BASIC UART 16SSOP; Manufacturer 1: FTDI, Future Technology Devices International Ltd; Supplier 1: Digi-Key; Supplier Part Number 1: 768-1135-1-ND

## Nets that join several sheets
1V8: IMU (12 pins), Power (C8.2 TP4.1 U3.5)
3V3: GPS (5 pins), IMU (C29.2 C31.2 U7.14 U8.14), MCU (18 pins), Power (7 pins), SD_CARD (C32.2 J5.4 R21.2 R22.2), USB (9 pins)
GND: GPS (13 pins), IMU (15 pins), MCU (25 pins), Power (10 pins), SD_CARD (6 pins), USB (12 pins)
USB 5V: Power (D5.1), USB (C4.1 J1.1 R5.2)
GPS_RX: GPS (R24.2 TP12.1), MCU (U4.54)
GPS_TX: GPS (R25.2 TP13.1), MCU (U4.53)
IMU_CS_3V3: IMU (U7.10), MCU (U4.20)
IMU_FSYNC_3V3: IMU (U8.12), MCU (U4.56)
IMU_INT_3V3: IMU (U8.13), MCU (U4.57)
IMU_SCK_3V3: IMU (U7.11), MCU (U4.21)
IMU_SDI_3V3: IMU (TP14.1 U7.13), MCU (U4.23)
IMU_SDO_3V3: IMU (TP15.1 U7.12), MCU (U4.22)
SD_CD: MCU (U4.39), SD_CARD (J5.10 R22.1)
SD_CS: MCU (U4.37), SD_CARD (J5.1)
SD_LED: MCU (U4.24), SD_CARD (R23.1)
SD_MISO: MCU (U4.35), SD_CARD (J5.7 TP17.1)
SD_MOSI: MCU (U4.36), SD_CARD (J5.2 TP16.1)
SD_SCK: MCU (U4.38), SD_CARD (J5.5)
SD_WP: MCU (U4.40), SD_CARD (J5.11 R21.1)
USB_RESET: MCU (U4.55), USB (R6.1 U1.11)
USB_USART_RX: MCU (TP11.1 U4.43), USB (U1.1)
USB_USART_TX: MCU (TP10.1 U4.42), USB (U1.4)